# EAGLE schematic dc_adapter (EAGLE 6.2)
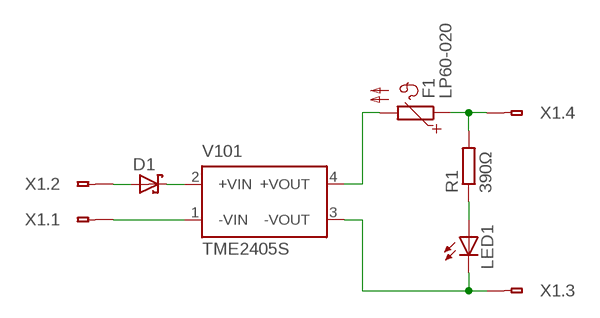
[diagram p0: schematic, sheet 1]

## Parts
D1  SCHOTTKY-DIODEDO35-7  [DO35-7]
F1  LP60-020  [LP60-020]
LED1  LED3MM  [LED3MM]
R1  390Ω  R_0204/2V  [0204V]
V101  TME2405S  [TME-24V]
X1  ST4  [STG4]

## Nets
N$1: V101.1(-VIN) X1.1
N$2: D1.C V101.2(+VIN)
N$3: D1.A X1.2
N$4: F1.P$2 V101.4(+VOUT)
N$5: LED1.K(C) V101.3(-VOUT) X1.3
N$6: LED1.A R1.1
N$7: F1.P$1 R1.2 X1.4

## Library data of the parts
D1 = diode:SCHOTTKY-DIODE: Schottky Diode
F1 = sicherung:LP60: Polymer PTC Datasheet: lp60.pdf <./eagle/doc/sicherung/lp60.pdf>
LED1 = led:LED: LED
R1 = passiv:R_: RESISTOR, European symbol
V101 = schaltregler:TME?*: DC/DC Converter TME Series 1 Watt traco_tme.pdf <./eagle/doc/schaltregler/traco_tme.pdf>; MPN: TME 2405S; OC_FARNELL: 1007547; OC_NEWARK: 51R5329
X1 = anschluss:ST4